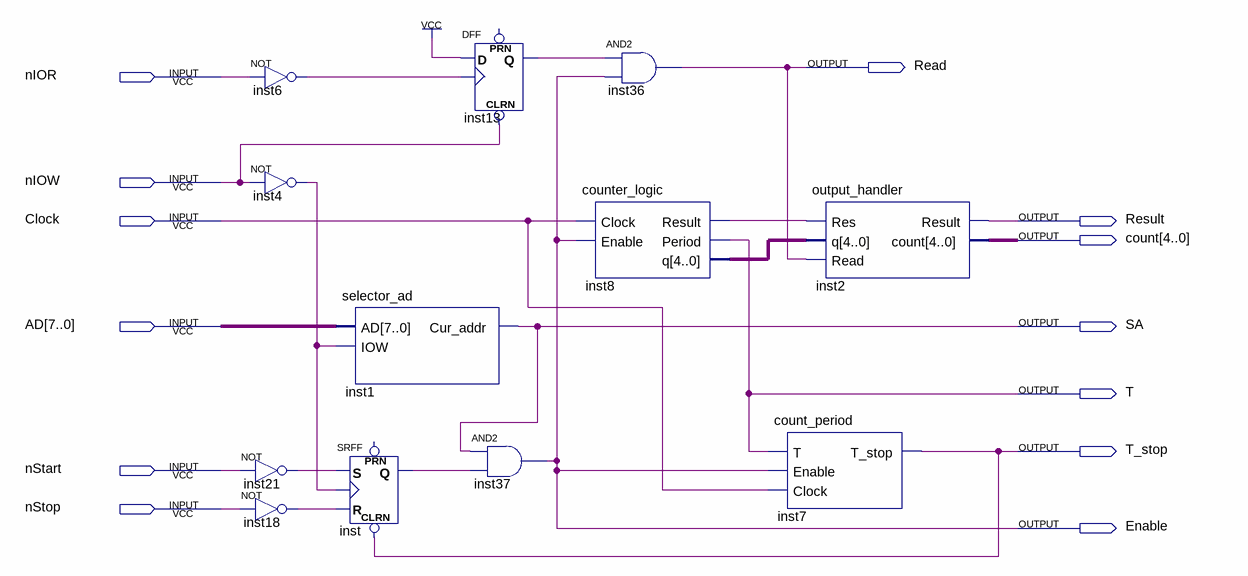
[diagram p0: schematic sheet]
// Quartus schematic interface.bdf as structural Verilog: 12 symbols, 13 pins
module \interface  (
  input  nIOR,
  input  nIOW,
  input  Clock,
  input  [7:0] AD,
  input  nStart,
  input  nStop,
  output Read,
  output Result,
  output [4:0] count,
  output SA,
  output T,
  output T_stop,
  output Enable
);

  wire inst4_out, inst6_out, inst8_result, inst13_q, inst18_out, inst21_out, inst_q;
  wire [4:0] inst8_q;

  not inst6 (inst6_out, nIOR);
  not inst4 (inst4_out, nIOW);
  not inst21 (inst21_out, nStart);
  not inst18 (inst18_out, nStop);
  selector_ad inst1 (.AD(AD), .IOW(inst4_out), .Cur_addr(SA));
  SRFF inst (.CLRN(T_stop), .S(inst21_out), .R(inst18_out), .CLK(inst4_out), .Q(inst_q));  // open: PRN
  DFF inst13 (.CLRN(nIOW), .CLK(inst6_out), .D(1'b1), .Q(inst13_q));  // open: PRN
  and inst37 (Enable, SA, inst_q);
  and inst36 (Read, inst13_q, Enable);
  counter_logic inst8 (.Clock(Clock), .Enable(Enable), .Result(inst8_result), .Period(T), .q(inst8_q));
  count_period inst7 (.T(T), .Enable(Enable), .Clock(Clock), .T_stop(T_stop));
  output_handler inst2 (.Res(inst8_result), .q(inst8_q), .Read(Read), .Result(Result), .count(count));
endmodule
